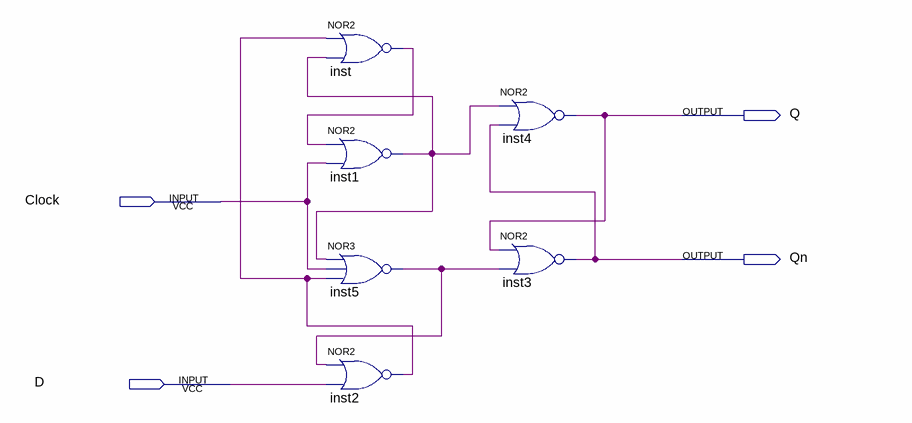
[diagram p0: schematic sheet]
// Quartus schematic lab9step3c.bdf as structural Verilog: 6 symbols, 4 pins
module lab9step3c (
  input  Clock,
  input  D,
  output Q,
  output Qn
);

  wire inst1_out, inst2_out, inst5_out, inst_out;

  nor inst (inst_out, inst2_out, inst1_out);
  nor inst1 (inst1_out, inst_out, Clock);
  nor inst5 (inst5_out, inst1_out, Clock, inst2_out);
  nor inst2 (inst2_out, inst5_out, D);
  nor inst4 (Q, inst1_out, Qn);
  nor inst3 (Qn, Q, inst5_out);
endmodule
